# EAGLE design DeltaApply (EAGLE 9.3.0)
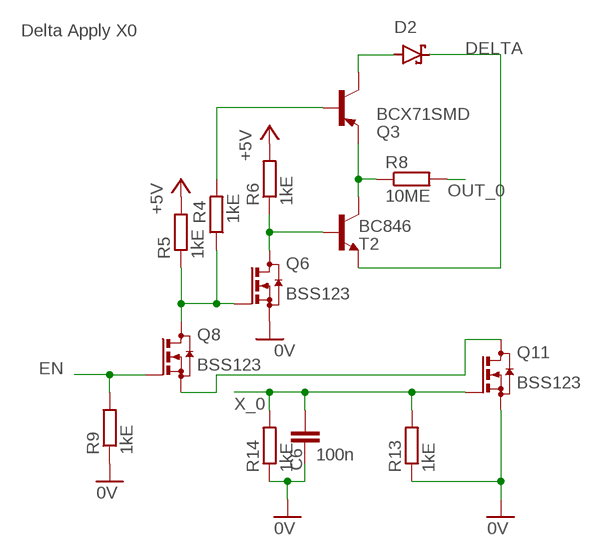
[diagram p0: schematic, sheet 1]

## Parts
C6  100n  C-EUC0805  [C0805]
D2  BAT60J  [SOD323_ST]
Q3  BCX71SMD  [SOT23]
Q6  BSS123  [SOT23]
Q8  BSS123  [SOT23]
Q11  BSS123  [SOT23]
R4  1kE  R-EU_M0805  [M0805]
R5  1kE  R-EU_M0805  [M0805]
R6  1kE  R-EU_M0805  [M0805]
R8  10ME  R-EU_M0805  [M0805]
R9  1kE  R-EU_M0805  [M0805]
R13  1kE  R-EU_M0805  [M0805]
R14  1kE  R-EU_M0805  [M0805]
T2  BC846  [SOT23]

## Nets
0V: C6.2 Q6.2(S) Q11.2(S) R9.1 R13.1 R14.1
+5V: R5.2 R6.2
DELTA: D2.C T2.2(E)
EN: Q8.1(G) R9.2
N$6: Q6.3(D) R6.1 T2.1(B)
N$7: Q8.2(S) Q11.3(D)
N$8: Q3.2(E) R8.1 T2.3(C)
N$31: D2.A Q3.3(C)
N$34: Q3.1(B) R4.2
N$35: Q6.1(G) Q8.3(D) R4.1 R5.1
OUT_0: R8.2
X_0: C6.1 Q11.1(G) R13.2 R14.2

## Notes on the sheet
- Delta Apply X0

## Library data of the parts
C6 = rcl:C-EU: CAPACITOR, European symbol; SPICEPREFIX: C
D2 = diode:BAT60J: Schottky barrier diode Source: www.st.com, BAT60J.pdf
Q3 = transistor-pnp:BCX71SMD: PNP Transistor
Q6 Q8 Q11 = transistor-small-signal:BSS123: N-CHANNEL MOS FET
R4-R6 R8 R9 R13 R14 = rcl:R-EU_: RESISTOR, European symbol; SPICEPREFIX: R
T2 = transistor:BC846: NPN TRANSISTOR

## Board
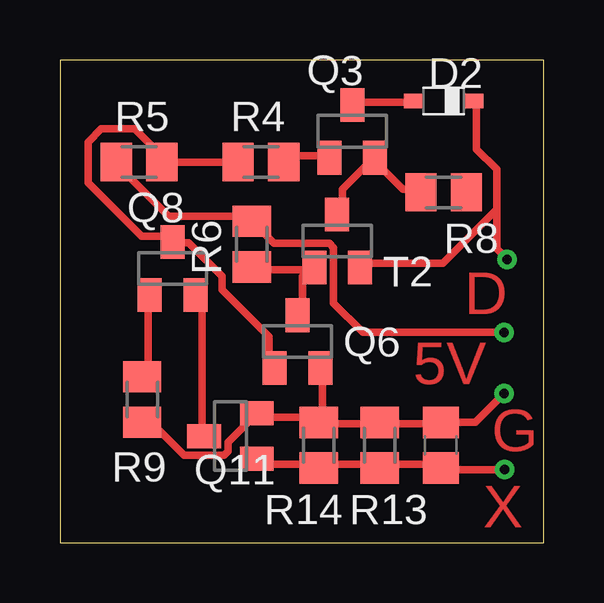
[diagram p1: board, top side]

Size 20.17 x 20.12 mm. Coordinates in mm from the lower left corner, seen from the top.
Outline: 0,0 20.17,0 20.17,20.12 0,20.12 0,0
Copper layers (1*16): Top 0.035mm / dielectric 1.5mm / Bottom 0.035mm
Design rules "default *": minimum track width 12mil, minimum drill 0.35mm, track to track 6mil, track to pad 6mil, pad to pad 6mil, via to via 6mil, smd to smd 6mil, copper to edge 40mil, drill to drill 6mil, minimum pad ring 10mil, minimum via ring 8mil, stop-mask expansion 4mil, vias tented up to drill 0mil, thermal gap 10mil

### Footprints (pad centres in the part's own frame; a part is rotated, then mirrored left to right if it is on the bottom)
C0805 = smd 1.3 x 1.5: 1 -0.95,0; 2 0.95,0
SOD323_ST = smd 0.8 x 0.6: A 1.25,0; C -1.25,0
SOT23 = smd 1 x 1.4: 1 -0.95,-1.1; 2 0.95,-1.1; 3 0,1.1
M0805 = smd 1.3 x 1.6: 1 -0.95,0; 2 0.95,0

### Placement (x,y rotation side)
C6  15.87,4.06 90 top
D2  16,18.41 180 top
Q3  12.19,17.14 0 top
Q6  9.91,8.38 0 top
Q8  4.7,11.43 0 top
Q11  7.11,4.45 90 top
R4  8.38,15.88 0 top
R5  3.3,15.88 180 top
R6  8,12.45 90 top
R8  16,14.61 0 top
R9  3.43,5.97 90 top
R13  13.33,4.06 270 top
R14  10.79,4.06 270 top
T2  11.56,12.57 0 top

### Tracks (layer width: path | path; a pad name or v marks a point on that pad's centre or on a via)
0V  (via drill 0.4)
  Top 0.305: R14.1 10.67,5.23 8.43,5.23 Q11.2 7.02,4.2 7.02,3.82 6.84,3.64 5.19,3.64 3.87,4.95 3.68,4.95 R9.1 | Q6.2 10.95,7.19 10.95,5.23 R14.1 | C6.2 15.7,4.95 13.46,4.95 R13.1 13.18,4.95 10.95,4.95 R14.1 | 15.98,4.95 C6.2 | C6.2 17.32,5.01 v18.53,6.22
+5V  (via drill 0.4)
  Top 0.305: R5.2 2.29,15.85 4.52,13.61 7.87,13.61 R6.2 8.92,12.48 11.23,12.48 11.41,12.3 11.41,9.98 12.63,8.76 v18.53,8.76
DELTA  (via drill 0.4)
  Top 0.305: 18.21,13.89 18.21,13.97 18.21,15.57 17.37,16.41 17.37,18.36 D2.C | 18.21,13.89 15.98,11.66 12.62,11.66 T2.2 | 18.21,13.89 18.21,12.25 v18.65,11.81
EN
  Top 0.305: Q8.1 3.68,10.26 3.68,7.19 R9.2
N$6
  Top 0.305: Q6.3 10.11,9.7 10.11,11.1 10.39,11.38 T2.1 10.11,11.38 8.15,11.38 R6.1
N$7
  Top 0.305: Q8.2 5.92,10.26 5.92,4.67 Q11.3
N$8
  Top 0.305: T2.3 11.79,13.89 11.79,14.73 12.9,15.85 Q3.2 13.18,15.85 14.3,14.73 14.86,14.73 R8.1
N$31
  Top 0.305: D2.A 14.58,18.36 12.34,18.36 Q3.3
N$34
  Top 0.305: Q3.1 11.23,16.13 9.55,16.13 R4.2
N$35
  Top 0.305: R4.1 7.32,15.85 4.52,15.85 R5.1 4.24,16.13 3.12,17.25 1.73,17.25 1.17,16.69 1.17,15.01 3.4,12.78 4.52,12.78 Q8.3 4.8,12.5 5.36,12.5 6.76,11.1 6.76,10.54 8.71,8.59 8.71,7.47 Q6.1
X_0  (via drill 0.4)
  Top 0.305: Q11.1 8.43,3.28 10.67,3.28 R14.2 10.95,3.28 13.18,3.28 R13.2 13.46,3.28 15.7,3.28 C6.1 15.94,3.05 v18.54,3.05

### Text on the board
Top: D | 5V | G | X